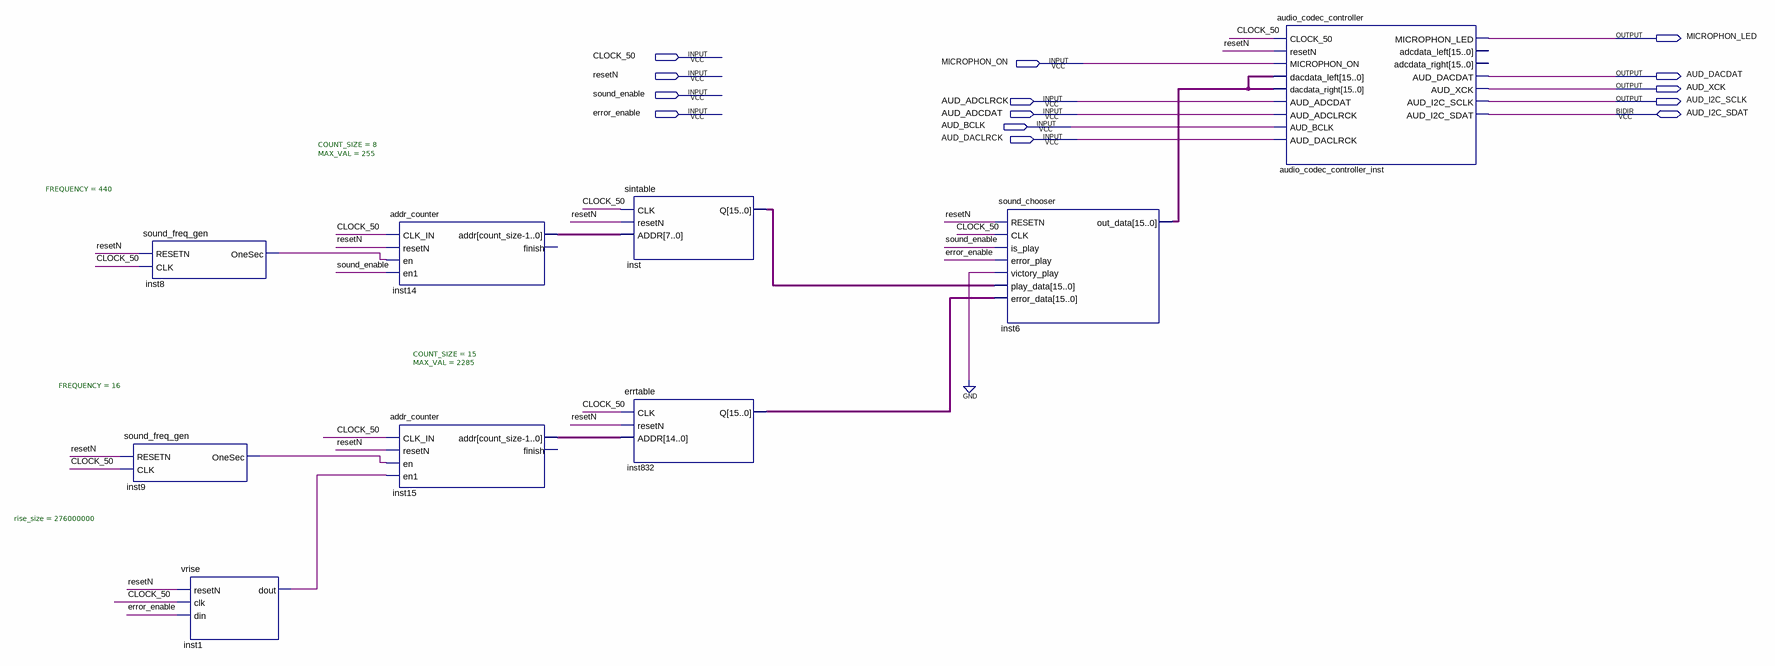
[diagram p0: schematic sheet]
// Quartus schematic audio_module_diag.bdf as structural Verilog: 9 symbols, 14 pins
module audio_module_diag (
  input  CLOCK_50,
  input  MICROPHON_ON,
  input  resetN,
  input  sound_enable,
  input  AUD_ADCLRCK,
  input  error_enable,
  input  AUD_ADCDAT,
  input  AUD_BCLK,
  input  AUD_DACLRCK,
  inout  AUD_I2C_SDAT,
  output MICROPHON_LED,
  output AUD_DACDAT,
  output AUD_XCK,
  output AUD_I2C_SCLK
);

  wire inst1_dout, inst8_onesec, inst9_onesec;
  wire [7:0] inst14_addr;
  wire [14:0] inst15_addr;
  wire [15:0] inst6_out_data, inst832_q, inst_q;

  sound_freq_gen #(.FREQUENCY(440)) inst8 (.RESETN(resetN), .CLK(CLOCK_50), .OneSec(inst8_onesec));
  sound_freq_gen #(.FREQUENCY(16)) inst9 (.RESETN(resetN), .CLK(CLOCK_50), .OneSec(inst9_onesec));
  vrise #(.rise_size(276000000)) inst1 (.resetN(resetN), .clk(CLOCK_50), .din(error_enable), .dout(inst1_dout));
  addr_counter #(.COUNT_SIZE(8), .MAX_VAL(255)) inst14 (
    .CLK_IN(CLOCK_50), .resetN(resetN), .en(inst8_onesec), .en1(sound_enable), .addr(inst14_addr));  // open: finish
  addr_counter #(.COUNT_SIZE(15), .MAX_VAL(2285)) inst15 (
    .CLK_IN(CLOCK_50), .resetN(resetN), .en(inst9_onesec), .en1(inst1_dout), .addr(inst15_addr));  // open: finish
  sintable inst (.CLK(CLOCK_50), .resetN(resetN), .ADDR(inst14_addr), .Q(inst_q));
  errtable inst832 (.CLK(CLOCK_50), .resetN(resetN), .ADDR(inst15_addr), .Q(inst832_q));
  sound_chooser inst6 (
    .RESETN(resetN), .CLK(CLOCK_50), .is_play(sound_enable), .error_play(error_enable), .victory_play(1'b0),
    .play_data(inst_q), .error_data(inst832_q), .out_data(inst6_out_data));
  audio_codec_controller audio_codec_controller_inst (
    .CLOCK_50(CLOCK_50), .resetN(resetN), .MICROPHON_ON(MICROPHON_ON), .dacdata_left(inst6_out_data),
    .dacdata_right(inst6_out_data), .AUD_ADCDAT(AUD_ADCLRCK), .AUD_ADCLRCK(AUD_ADCDAT), .AUD_BCLK(AUD_BCLK),
    .AUD_DACLRCK(AUD_DACLRCK), .MICROPHON_LED(MICROPHON_LED), .AUD_DACDAT(AUD_DACDAT), .AUD_XCK(AUD_XCK),
    .AUD_I2C_SCLK(AUD_I2C_SCLK), .AUD_I2C_SDAT(AUD_I2C_SDAT));  // open: adcdata_left, adcdata_right
endmodule
